# Altium schematic sheet Audio.SchDoc: Audio
size A4; Project: STM32H7-DK; Date: Not used; ApprovedBy: Not used; CheckedBy: Not used; Author: Not used; CompanyName: STMicroelectronics; DrawnBy: Not used; Engineer: Not used; Organization: Not used; Address1: Not used; Address2: Not used; Address3: Not used; Address4: Not used; DocumentNumber: Not used; Revision: Not used; SheetNumber: 6; SheetTotal: 16; CurrentTime: Not used; CurrentDate: Not used; Time: Not used; DocumentFullPathAndName: Not used; DocumentName: Not used; ModifiedDate: Not used; ImagePath: Not used; ProjectName: Not used; Application_BuildNumber: Not used
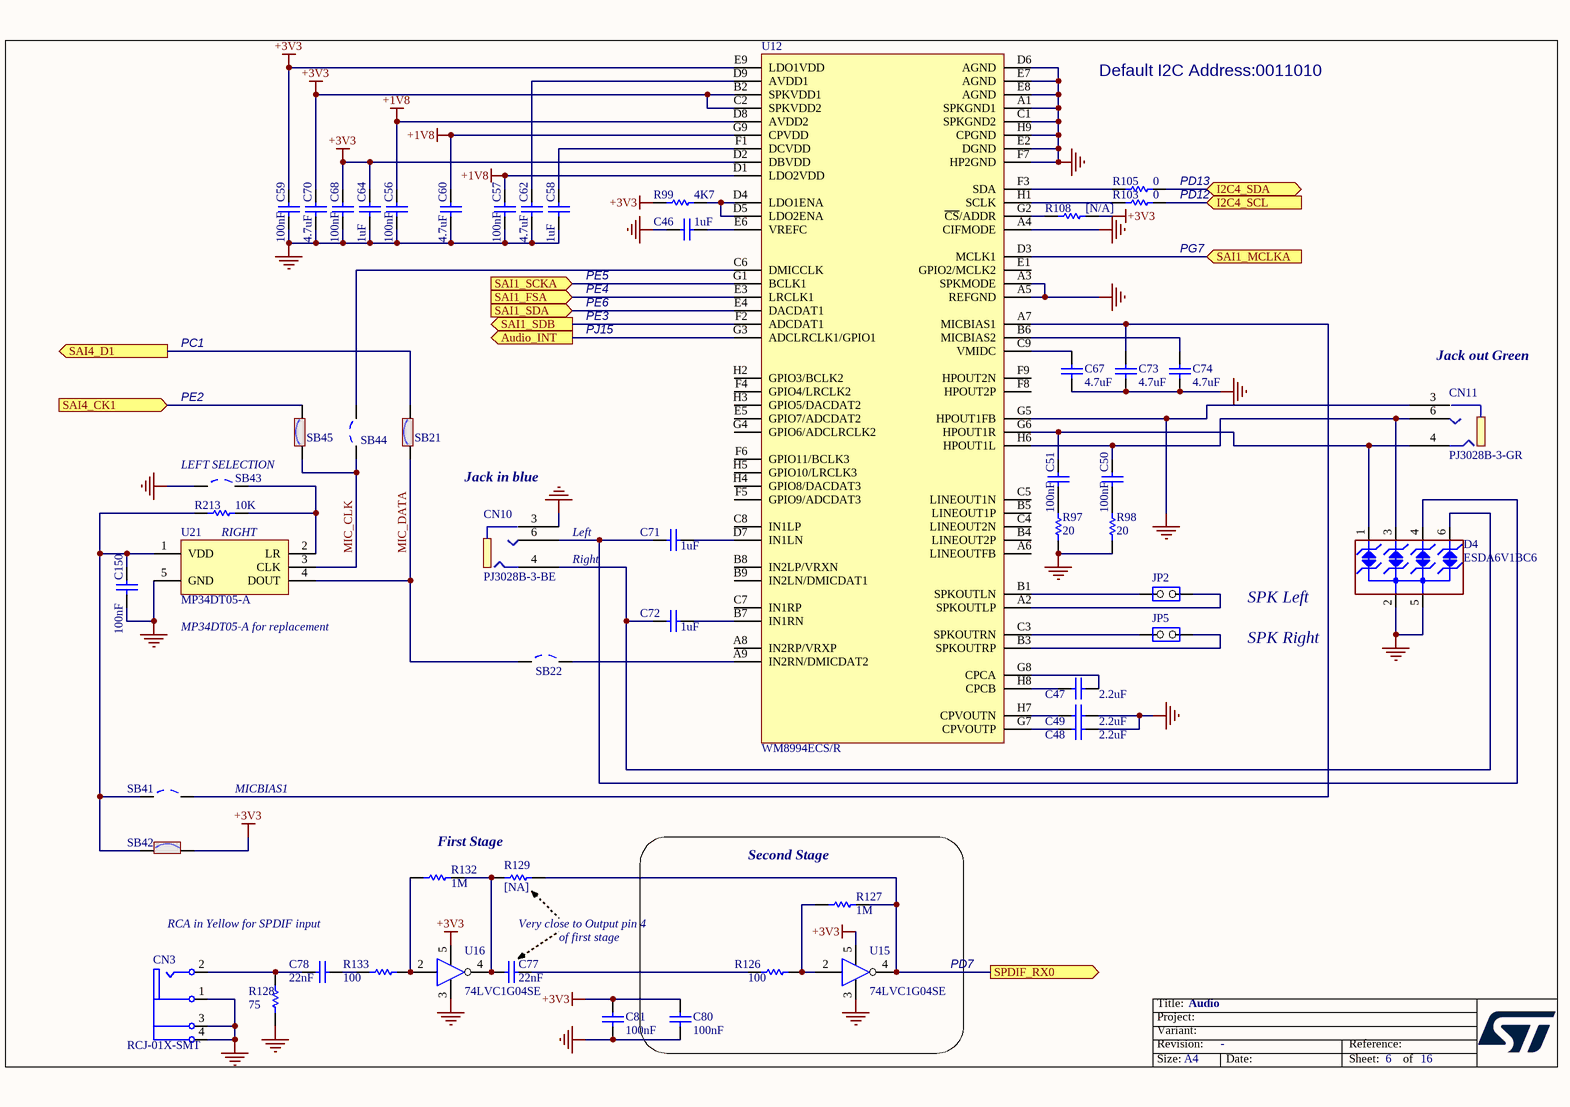
[diagram p0: Audio.SchDoc]

## Parts
C46  1uF  [0603C]
C47  2.2uF  [0603C]
C48  2.2uF  [0603C]
C49  2.2uF  [0603C]
C50  100nF  [0603C]
C51  100nF  [0603C]
C56  100nF  [0603C]
C57  100nF  [0603C]
C58  1uF  [0603C]
C59  100nF  [0603C]
C60  4.7uF  [0603C]
C62  4.7uF  [0603C]
C64  1uF  [0603C]
C67  4.7uF  [0603C]
C68  100nF  [0603C]
C70  4.7uF  [0603C]
C71  1uF  [0603C]
C72  1uF  [0603C]
C73  4.7uF  [0603C]
C74  4.7uF  [0603C]
C77  22nF  [0603C]
C78  22nF  [0603C]
C80  100nF  [0603C]
C81  100nF  [0603C]
C150  100nF  [0603C]
CN3  RCJ-01X-SMT  [RCA_3SM_1TH_14X15]
CN10  PJ3028B-3-BE  [PJ3028B]
CN11  PJ3028B-3-GR  [PJ3028B]
D4  ESDA6V1BC6  [SOT23-6L]
JP2  (no value)  [SIP2]
JP5  (no value)  [SIP2]
R97  20  [0603R]
R98  20  [0603R]
R99  4K7  [0603R]
R103  0  [0603R]
R105  0  [0603R]
R108  [N/A]  [0603R]
R126  100  [0603R]
R127  1M  [0603R]
R128  75  [0603R]
R129  [NA]  [0603R]
R132  1M  [0603R]
R133  100  [0603R]
R213  10K  [0603R]
SB21  Solder Bridge ON  [SB_0603]  (value not drawn)
SB22  Solder Bridge OFF  [SB_0603]  (value not drawn)
SB41  Solder Bridge OFF  [SB_0603]  (value not drawn)
SB42  Solder Bridge ON  [SB_0603]  (value not drawn)
SB43  Solder Bridge OFF  [SB_0603]  (value not drawn)
SB44  Solder Bridge OFF  [SB_0603]  (value not drawn)
SB45  Solder Bridge ON  [SB_0603]  (value not drawn)
U12  WM8994ECS/R  [BGA72_0R5_4R5X4]
U15  74LVC1G04SE  [SOT-353]
U16  74LVC1G04SE  [SOT-353]
U21  MP34DT05-A  [MP34DT01TR]

## Blocks framed on the sheet
Second Stage: C80 R126 R127 U15

## Ports
Audio_INT (out), I2C4_SCL (in), I2C4_SDA (bidir), SAI1_FSA (in), SAI1_MCLKA (in), SAI1_SCKA (in), SAI1_SDA (in), SAI1_SDB (out), SAI4_CK1 (in), SAI4_D1 (out), SPDIF_RX0 (out)

## Nets
+1V8: C56.1 C57.1 C60.1 U12.D1(LDO2VDD) U12.D8(AVDD2) U12.G9(CPVDD)
+3V3: C59.1 C64.1 C68.1 C70.1 C80.2 C81.2 R99.2 R108.2 SB42.2 U12.B2(SPKVDD1) U12.C2(SPKVDD2) U12.D2(DBVDD) U12.E9(LDO1VDD) U15.5(VCC) U16.5(VCC)
GND: C46.2 C48.2 C49.2 C56.2 C57.2 C58.2 C59.2 C60.2 C62.2 C64.2 C67.1 C68.2 C70.2 C73.1 C74.1 C80.1 C81.1 C150.2 CN3.1(Ground) CN3.3(Ground) CN3.4(Ground) CN10.3 CN11.3 D4.2(IO2) D4.5(IO4) R97.2 R98.2 R128.1 SB43.1 U12.A1(SPKGND1) U12.A3(SPKMODE) U12.A4(CIFMODE) U12.A5(REFGND) U12.C1(SPKGND2) U12.D6(AGND) U12.E2(DGND) U12.E7(AGND) U12.E8(AGND) U12.F7(HP2GND) U12.G5(HPOUT1FB) U12.H9(CPGND) U15.3(GND) U16.3(GND) U21.5(GND)
Audio_INT: U12.G3(ADCLRCLK1/GPIO1) ; port Audio_INT
I2C4_SCL: R103.1 ; port I2C4_SCL
I2C4_SDA: R105.1 ; port I2C4_SDA
MIC_CLK: SB44.1 SB45.1 U21.3(CLK)
MIC_DATA: SB21.1 SB22.1 U21.4(DOUT)
SAI1_FSA: U12.E3(LRCLK1) ; port SAI1_FSA
SAI1_MCLKA: U12.D3(MCLK1) ; port SAI1_MCLKA
SAI1_SCKA: U12.G1(BCLK1) ; port SAI1_SCKA
SAI1_SDA: U12.E4(DACDAT1) ; port SAI1_SDA
SAI1_SDB: U12.F2(ADCDAT1) ; port SAI1_SDB
SAI4_CK1: SB45.2 ; port SAI4_CK1
SAI4_D1: SB21.2 ; port SAI4_D1
SPDIF_RX0: R127.2 R129.2 U15.4(Y) ; port SPDIF_RX0
NetC46_1: C46.1 U12.E6(VREFC)
NetC47_1: C47.1 U12.H8(CPCB)
NetC47_2: C47.2 U12.G8(CPCA)
NetC48_1: C48.1 U12.G7(CPVOUTP)
NetC49_1: C49.1 U12.H7(CPVOUTN)
NetC50_1: C50.1 CN11.6 D4.3(GND) U12.H6(HPOUT1L)
NetC50_2: C50.2 R98.1
NetC51_1: C51.1 CN11.4 D4.1(IO1) U12.G6(HPOUT1R)
NetC51_2: C51.2 R97.1
NetC58_1: C58.1 U12.F1(DCVDD)
NetC62_1: C62.1 U12.D9(AVDD1)
NetC67_2: C67.2 U12.C9(VMIDC)
NetC71_1: C71.1 U12.D7(IN1LN)
NetC71_2: C71.2 CN10.6 D4.4(IO3)
NetC72_1: C72.1 U12.B7(IN1RN)
NetC72_2: C72.2 CN10.4 D4.6(NC)
NetC73_2: C73.2 SB41.2 U12.A7(MICBIAS1)
NetC74_2: C74.2 U12.B6(MICBIAS2)
NetC77_1: C77.1 R129.1 R132.2 U16.4(Y)
NetC77_2: C77.2 R126.1
NetC78_1: C78.1 CN3.2(Signal) R128.2
NetC78_2: C78.2 R133.1
NetC150_1: C150.1 R213.2 SB41.1 SB42.1 U21.1(VDD)
NetJP2_1: JP2.1(COMMON) U12.A2(SPKOUTLP)
NetJP2_2: JP2.2(NO) U12.B1(SPKOUTLN)
NetJP5_1: JP5.1(COMMON) U12.B3(SPKOUTRP)
NetJP5_2: JP5.2(NO) U12.C3(SPKOUTRN)
NetR99_1: R99.1 U12.D4(LDO1ENA) U12.D5(LDO2ENA)
NetR103_2: R103.2 U12.H1(SCLK)
NetR105_2: R105.2 U12.F3(SDA)
NetR108_1: R108.1 U12.G2(~{CS}/ADDR)
NetR126_2: R126.2 R127.1 U15.2(A)
NetR132_1: R132.1 R133.2 U16.2(A)
NetR213_1: R213.1 SB43.2 U21.2(LR)
NetSB22_2: SB22.2 U12.A9(IN2RN/DMICDAT2)
NetSB44_2: SB44.2 U12.C6(DMICCLK)

Not connected (* = marked no-connect by the designer): U12 A6(LINEOUTFB) A8(IN2RP/VRXP) B4(LINEOUT2P) B5(LINEOUT1P) B8(IN2LP/VRXN) B9(IN2LN/DMICDAT1) C4(LINEOUT2N) C5(LINEOUT1N) C7(IN1RP) C8(IN1LP) E1(GPIO2/MCLK2) E5(GPIO7/ADCDAT2) F4(GPIO4/LRCLK2) F5(GPIO9/ADCDAT3) F6(GPIO11/BCLK3) F8(HPOUT2P) F9(HPOUT2N) G4(GPIO6/ADCLRCLK2) H2(GPIO3/BCLK2) H3(GPIO5/DACDAT2) H4(GPIO8/DACDAT3) H5(GPIO10/LRCLK3); U15 1(NC); U16 1(NC)

## Notes on the sheet
- Default I2C Address:0011010
- PD13
- PD12
- PE5
- PG7
- PC1
- PE6
- PE4
- PE3
- PJ15
- PE2
- (near CN11) Jack out Green
- (near SB43) LEFT SELECTION
- Jack in blue
- RIGHT
- Left
- Right
- SPK Left
- MP34DT05-A for replacement
- SPK Right
- MICBIAS1
- First Stage
- RCA in Yellow for SPDIF input
- Very close to Output pin 4
- of first stage
- PD7
- Title:
- Project:
- Size:
- Revision:
- Variant:
- A4
- -
- Date:
- Reference:
- Sheet:
- of

## Library data of the parts
C46-C49 C58 C64 = CAP: Capacitor; Value: 100nF; Published: 8-Jun-2000; Revision: July-2002: Re-released for DXP Platform.; Publisher: Altium Limited
C50 C51 C56 C57 C59 C60 C62 C67 C68 C70 C73 C74 C150 = Cap: Capacitor; Value: 10nF; Published: 8-Jun-2000; Revision: July-2002: Re-released for DXP Platform.; Publisher: Altium Limited
C71 C72 = Cap_1uF_X5R_10%_0603: Capacitor,1uF,16V,X5R,10%,0603,YAGEO; Manuf_Part_1: CC0603KRX5R7BB105; Revision: July-2002: Re-released for DXP Platform.; Value: 1uF; Order: CC0603KRX5R7BB105; Manuf_1: YAGEO; ECCN_US/EU: n/a
C77 C78 = Cap_22nF_X7R_10%_0402: Capacitor,22nF,16V,X7R,10%,0402,YAGEO; Revision: July-2002: Re-released for DXP Platform.; Value: 22nF; Manuf_1: YAGEO; ECCN_US/EU: n/a
C80 C81 = CAP: Capacitor; Published: 8-Jun-2000; Revision: July-2002: Re-released for DXP Platform.; Publisher: Altium Limited; Value: 100nF
CN3 = RCA_SMD: RCA Phono Jack, Right Angle, SMD, Yellow; Manuf_Part_1: JBB0819100002; Manuf_1: JIUBABA; Manuf_2: CUI Inc; Manuf_Part_2: RCJ-014-SMT; Distrib: Sub Co
CN10 = PJ3028B-3-TR: Connector Jack Stereo 3.5mm, female SMT, Blue (Line input); Manuf_Part_1: PJ3028B-3_BE; Manuf_Part_2: PJ30280-3_BE; ECCN_US/EU: n/a; Manuf_1: http://ww.qiaod.com
CN11 = PJ3028B-3-TR: Connector Jack Stereo 3.5mm, female SMT, Green (Line input); Manuf_Part_1: PJ3028B-3_GR; Manuf_Part_2: PJ30280-3_GR; ECCN_US/EU: n/a; Manuf_1: http://ww.qiaod.com
D4 = ESDA6V1BC6: 4-line ESD protection; Manuf_1: STM; Ref St: 9179034; Fitted: YES; ECCN_US/EU: EAR99/NEC; Manuf_Part_1: ESDA6V1BC6; Distrib: ST; Order: ESDA6V1BC6; Ordered by: STM
JP2 JP5 = JP2
R97-R99 R103 R105 R213 = Res1: Resistor; Value: 1K; Published: 8-Jun-2000; Revision: July-2002: Re-released for DXP Platform.; Publisher: Altium Limited
R108 = res1: Resistor; Value: 1K; Ordered by: Subcon; ECCN_US/EU: NA; Fitted: NO; Published: 8-Jun-2000; Revision: July-2002: Re-released for DXP Platform.; Publisher: Altium Limited
R126 = Res_100_1%_0402: Resistor,100,0402,1%,YAGEO; Value: 100; Manuf_1: YAGEO; ECCN_US/EU: n/a; Distrib: FARNELL
R127 R132 = res1: Resistor, 1M , 0603; Ordered by: Subcon; ECCN_US/EU: NA; Published: 8-Jun-2000; Revision: July-2002: Re-released for DXP Platform.; Publisher: Altium Limited; Value: 1M
R128 = Res_75_1%_0402: Resistor,75,0402,1%,YAGEO; Order: 311-75.0LRTR-ND; Value: 75; Manuf_1: YAGEO; ECCN_US/EU: n/a; Distrib: DIGIKEY
R129 = Res_NA_0402: Resistor,[NA],0402; Fitted: NO; Value: [NA]; ECCN_US/EU: n/a
R133 = Res_100_1%_0402: Resistor,100,0402,1%,YAGEO; Order: 9239111; Value: 100; Manuf_1: YAGEO; ECCN_US/EU: n/a; Distrib: FARNELL
SB21 SB42 SB45 = SB_ON: Fitted: YES; Ordered by: Subcon; Revision: July-2002: Re-released for DXP Platform.; ECCN_US/EU: n/a
SB22 SB41 SB43 SB44 = SB_OFF: Fitted: NO; Ordered by: Subcon; Revision: July-2002: Re-released for DXP Platform.; ECCN_US/EU: n/a
U12 = WM8994ECS/R: Manuf_1: Wolfson; Ordered by: Subcon; ECCN_US/EU: EAR99/NEC; Fitted: YES; Manuf_Part_1: WM8994ECS/R
U15 U16 = 74LVC1G04SE: Single inverter gate with a standard push-pull output. (1.65V to 5.5V); Manuf_Part_1: 74LVC1G04SE-7; Manuf_1: DIODES; Ordered by: Subcon; Fitted: YES; ECCN_US/EU: EAR99/NEC; Distrib: FARNELL
U21 = MP34DT01TR: MEMS audio sensor; Ordered by: STM; ECCN_US/EU: EAR99/NEC; Fitted: YES; Revision: 17-Jul-2002: Re-released for DXP Platform.; Publisher: Altium Limited; Manuf_1: STM; Manuf_Part_1: MP34DT05-A